# EAGLE design Qwiic_UV_Sensor_VEML6075 (EAGLE 9.1.0)
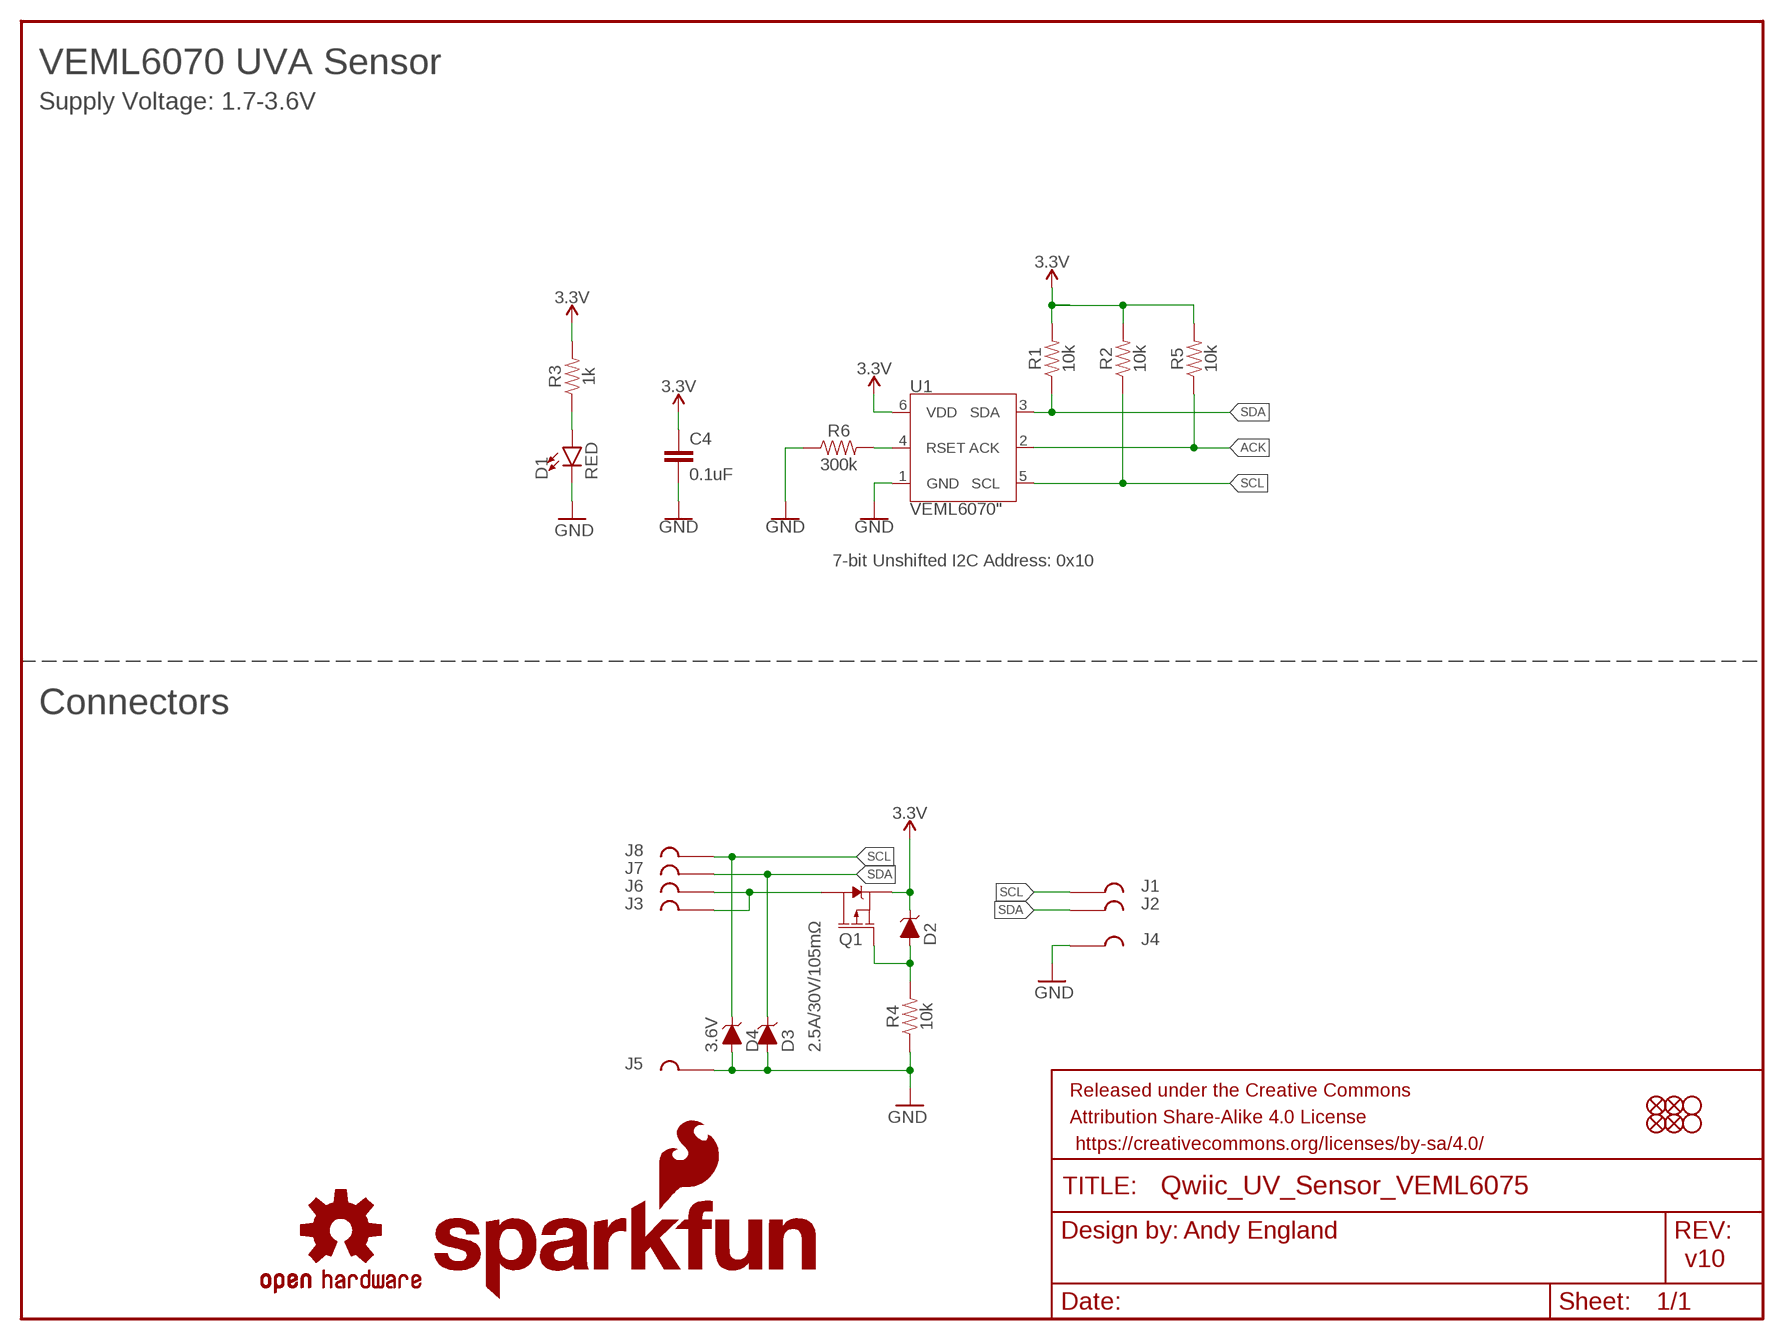
[diagram p0: schematic, sheet 1]

## Parts
C4  0.1uF  0.1UF-0603-25V-(+80/-20%)  [0603]
D1  RED  LED-RED0603  [LED-0603]
D2  3.6V  DIODE-ZENER-BZT52C3V6S  [SOD-323]
D3  3.6V  DIODE-ZENER-BZT52C3V6S  [SOD-323]
D4  3.6V  DIODE-ZENER-BZT52C3V6S  [SOD-323]
FRAME1  FRAME-LETTER  [CREATIVE_COMMONS]
J1  GATORGATOR_MINI  [GATOR_MINI]
J2  GATORGATOR_MINI  [GATOR_MINI]
J3  GATORGATOR_MINI  [GATOR_MINI]
J4  GATORGATOR_MINI  [GATOR_MINI]
J5  GATORGATOR_MINI  [GATOR_MINI]
J6  GATORGATOR_MINI  [GATOR_MINI]
J7  GATORGATOR_MINI  [GATOR_MINI]
J8  GATORGATOR_MINI  [GATOR_MINI]
JP2  FIDUCIALUFIDUCIAL  [MICRO-FIDUCIAL]
JP3  STAND-OFF  [STAND-OFF]
JP4  STAND-OFF  [STAND-OFF]
JP5  FIDUCIALUFIDUCIAL  [MICRO-FIDUCIAL]
JP6  FIDUCIALUFIDUCIAL  [MICRO-FIDUCIAL]
JP7  FIDUCIALUFIDUCIAL  [MICRO-FIDUCIAL]
LOGO1  OSHW-LOGOMINI  [OSHW-LOGO-MINI]
Q1  2.5A/30V/105mΩ  MOSFET_PCH-DMG2307L  [SOT23-3]
R1  10k  10KOHM-0603-1/10W-1%  [0603]
R2  10k  10KOHM-0603-1/10W-1%  [0603]
R3  1k  1KOHM-0603-1/10W-1%  [0603]
R4  10k  10KOHM-0603-1/10W-1%  [0603]
R5  10k  10KOHM-0603-1/10W-1%  [0603]
R6  300k  300KOHM-0603-1/10W-1%  [0603]
U1  VEML6070"  [VEML6070]
U$1  SFE_LOGO_NAME_FLAME.1_INCH  [SFE_LOGO_NAME_FLAME_.1]
U$2  SFE_LOGO_NAME_FLAME.1_INCH  [SFE_LOGO_NAME_FLAME_.1]

## Nets
3.3V: C4.1 D2.C Q1.2(S) R1.2 R2.2 R3.2 R5.2 U1.6(VDD)
ACK: R5.1 U1.2(ACK)
GND: C4.2 D1.C D3.A D4.A J4.P$2 J5.P$2 R4.1 R6.1 U1.1(GND)
N$1: J3.P$2 J6.P$2 Q1.3(D)
N$2: R6.2 U1.4(RSET)
N$3: D1.A R3.1
N$4: D2.A Q1.1(G) R4.2
SCL: D4.C J1.P$2 J8.P$2 R2.1 U1.5(SCL)
SDA: D3.C J2.P$2 J7.P$2 R1.1 U1.3(SDA)

## Notes on the sheet
- VEML6070 UVA Sensor
- Supply Voltage: 1.7-3.6V
- 7-bit Unshifted I2C Address: 0x10
- Connectors
- Andy England
- v10

## Library data of the parts
C4 = SparkFun-Capacitors:0.1UF: 0.1µF ceramic capacitors A capacitor is a passive two-terminal electrical component used to store electrical energy temporarily in an electric field.; PROD_ID: CAP-00810
D1 = SparkFun-LED:LED-RED: Red SMD LED Used in manufacturing of most products at SparkFun Packages: 0603 - SMD 0603 package [Product Link] <http://docs.avagotech.com/docs/AV02-0551EN> 0603 SMART - SMD 0603 SMART package ( more efficient and expensive)[Product Link] <http://www.osram-os.com/Graphics/XPic2/00077099_0.pdf> 1206 - SMD1206 package [Product Link] <https://www.sparkfun.com/datasheets/DevTools/LilyPad/Q150OVS4.pdff> SparkFun Products: Pro Mini 328 -5V <https://www.sparkfun.com/products/821> RedBoard <https://www.sparkfun.com/products/12757> IOIO-OTG <https://www.sparkfun.com/products/13613>; PROD_ID: DIO-00819
D2-D4 = SparkFun-DiscreteSemi:DIODE-ZENER: Zener Diode A Zener diode allows current to flow from its anode to its cathode like a normal semiconductor diode, but it also permits current to flow in the reverse direction when its "Zener voltage" is reached. - WIkipedia; PROD_ID: DIO-08199
FRAME1 = SparkFun-Aesthetics:FRAME-LETTER: Schematic Frame - Letter Standard 8.5x11 US Letter frame
J1-J8 = SparkFun-Connectors:GATOR
JP2 JP5-JP7 = SparkFun:FIDUCIAL: Fiducial Alignment Points Various fiducial points for machine vision alignment.
JP3 JP4 = SparkFun:STAND-OFF: Stand Off This is the mechanical footprint for a #4 phillips button head screw. Use the keepout ring to avoid running the screw head into surrounding components. SKU : PRT-00447
LOGO1 = SparkFun-Aesthetics:OSHW-LOGO: Open-Source Hardware (OSHW) Logo This logo indicates the piece of hardware it is found on incorporates a OSHW license and/or adheres to the definition of open source hardware found here: http://freedomdefined.org/OSHW
Q1 = SparkFun-DiscreteSemi:MOSFET_PCH: P-channel MOSFETs Voltage controlled devices that allow control of high current outputs. SparkFun Products: SparkFun ESP32 Thing <https://www.sparkfun.com/products/13907> SparkFun ESP8266 Thing <https://www.sparkfun.com/products/13231>; PROD_ID: TRANS-11308
R1 R2 R4 R5 = SparkFun-Resistors:10KOHM: 10kΩ resistor A resistor is a passive two-terminal electrical component that implements electrical resistance as a circuit element. Resistors act to reduce current flow, and, at the same time, act to lower voltage levels within circuits. - Wikipedia; PROD_ID: RES-00824
R3 = SparkFun-Resistors:1KOHM: 1kΩ resistor A resistor is a passive two-terminal electrical component that implements electrical resistance as a circuit element. Resistors act to reduce current flow, and, at the same time, act to lower voltage levels within circuits. - Wikipedia; PROD_ID: RES-07856
R6 = SparkFun-Resistors:300KOHM: 300kΩ resistor A resistor is a passive two-terminal electrical component that implements electrical resistance as a circuit element. Resistors act to reduce current flow, and, at the same time, act to lower voltage levels within circuits. - Wikipedia; PROD_ID: RES-10809
U1 = SparkFun-Sensors:VEML6070
U$1 U$2 = SparkFun-Aesthetics:SFE_LOGO_NAME_FLAME: SparkFun Font Logo w/ Flame This is the SparkFun full logo. The logo on the schematic will always be the same size; the package variant is the height of the flame part of the logo. Default layer for the logo on the board is tSilk.

## Board
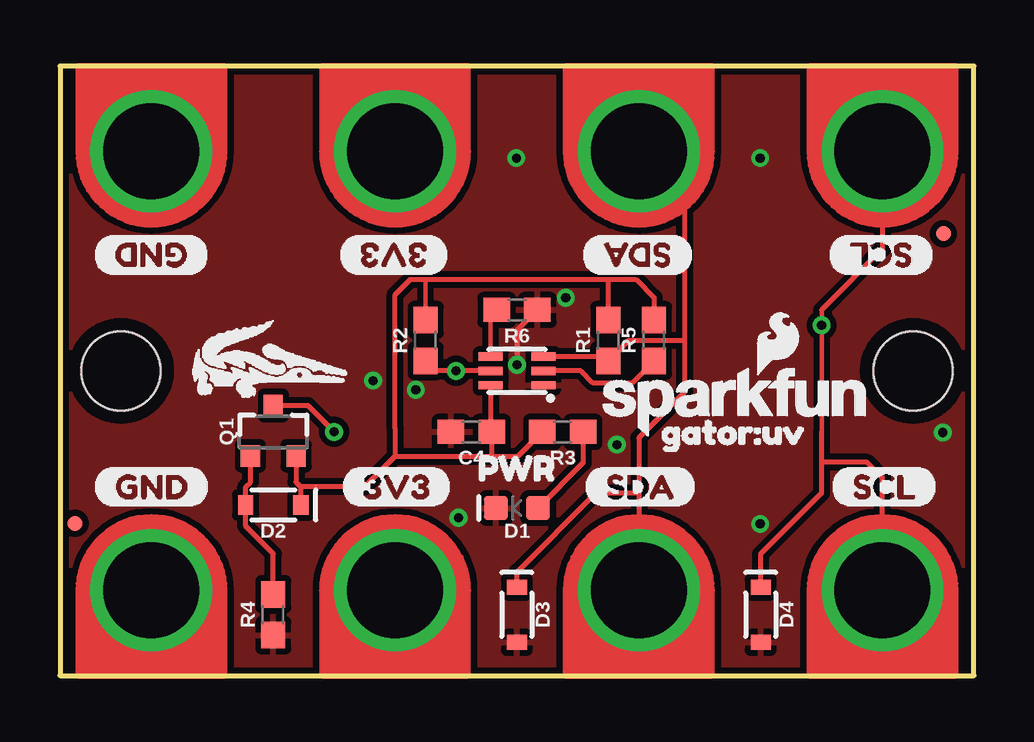
[diagram p1: board, top side]
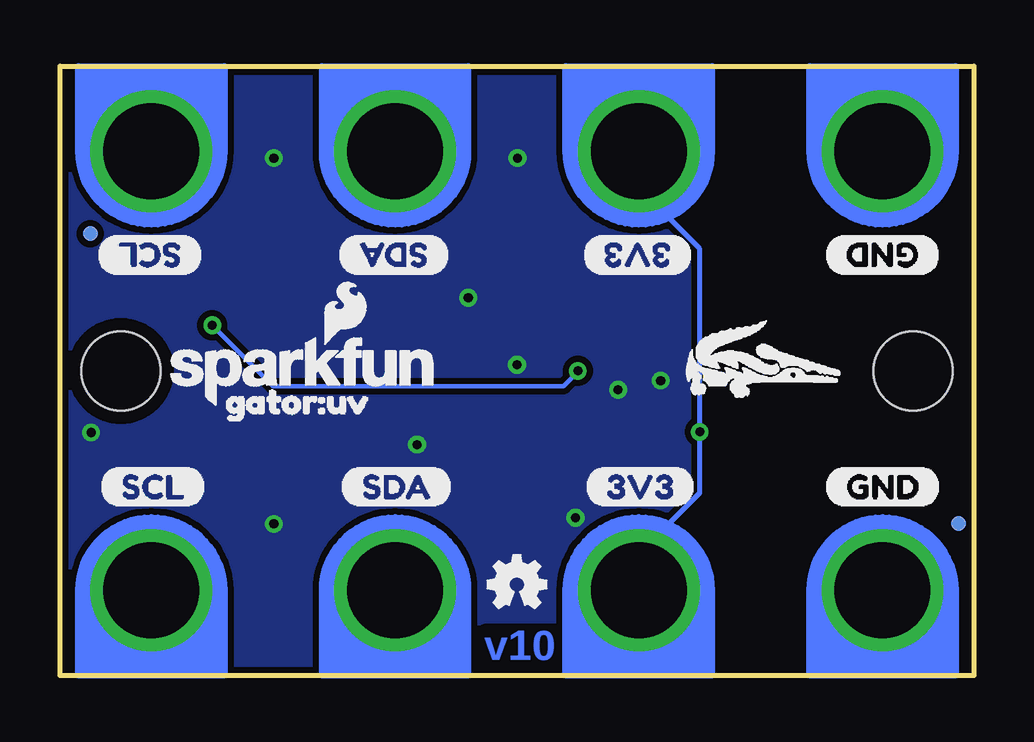
[diagram p2: board, bottom side, seen from below]

Size 38.1 x 25.4 mm. Coordinates in mm from the lower left corner, seen from the top.
Outline: 0,0 38.1,0 38.1,25.4 0,25.4 0,0
Copper layers (1*16): Top 0.035mm / dielectric 1.5mm / Bottom 0.035mm
Design rules "SparkFun-2-layer-TIGHT": minimum track width 7mil, minimum drill 15mil, track to track 7mil, track to pad 7mil, pad to pad 7mil, via to via 7mil, smd to smd 7mil, copper to edge 7mil, drill to drill 7mil, minimum pad ring 7mil, minimum via ring 7mil, stop-mask expansion 4mil, vias tented up to drill 25mil, thermal gap 10mil

### Footprints (pad centres in the part's own frame; a part is rotated, then mirrored left to right if it is on the bottom)
0603 = smd 1.1 x 1: 1 -0.85,0; 2 0.85,0
LED-0603 = smd 1 x 1: A -0.877,0; C 0.877,0
SOD-323 = smd 0.63 x 0.83: A 1.15,0; C -1.15,0
GATOR_MINI = drill 4 pad 5.08: P$2 0,-0.254
MICRO-FIDUCIAL = smd 0.635 x 0.635: 1 0,0
STAND-OFF = hole 3.302: 0,0
SOT23-3 = smd 0.8 x 0.9: 1 -0.95,-1; 2 0.95,-1; 3 0,1.1
VEML6070 = smd 1 x 0.35: 1 -1.1,0.6; 2 -1.1,0; 3 -1.1,-0.6; 4 1.1,-0.6; 5 1.1,0; 6 1.1,0.6

### Placement (x,y rotation side)
C4  17.14,10.16 180 top
D1  19.05,6.99 180 top
D2  8.89,7.11 180 top
D3  19.05,2.54 270 top
D4  29.21,2.54 270 top
FRAME1  -11.43,-7.62 0 top  (outside the outline)
J1  34.29,3.81 0 top
J2  24.13,3.81 0 top
J3  13.97,3.81 0 top
J4  3.81,3.81 0 top
J5  3.81,21.59 180 top
J6  13.97,21.59 180 top
J7  24.13,21.59 180 top
J8  34.29,21.59 180 top
JP2  0.64,6.35 0 bottom
JP3  2.54,12.7 0 top
JP4  35.56,12.7 90 top
JP5  0.64,6.35 0 top
JP6  36.83,18.41 0 top
JP7  36.83,18.41 0 bottom
LOGO1  19.05,3.81 0 bottom
Q1  8.89,10.16 0 top
R1  22.86,13.97 90 top
R2  15.24,13.97 90 top
R3  20.95,10.16 180 top
R4  8.89,2.54 90 top
R5  24.77,13.97 90 top
R6  19.05,15.24 180 top
U1  19.05,12.7 180 top
U$1  28.19,11.43 0 top
U$2  27.94,12.7 0 bottom
U$3  [3V33]  11.68,7.87 0 top
U$4  [GND0]  1.4,7.87 0 top
U$5  [SCL2]  32.13,7.87 0 top
U$6  [GATOR#UV5]  24.13,10.16 0 top
U$7  [SDA1]  21.84,7.87 0 top
U$8  [3V33]  11.68,17.53 180 bottom
U$9  [GND0]  1.4,17.53 180 bottom
U$10  [ORDERING_INSTRUCTIONS]  1.27,-10.16 0 top  (outside the outline)
U$11  [SCL2]  32.13,17.53 180 bottom
U$12  [SDA1]  21.84,17.53 180 bottom
U$13  [GND0]  6.22,17.53 180 top
U$14  [3V33]  16.26,17.53 180 top
U$15  [SDA1]  26.42,17.53 180 top
U$17  [SCL2]  36.45,17.53 180 top
U$18  [GND0]  6.22,7.87 0 bottom
U$19  [3V33]  16.26,7.87 0 bottom
U$20  [SDA1]  26.42,7.87 0 bottom
U$21  [SCL2]  36.45,7.87 0 bottom
U$22  [GATORBIT_FINAL_FOR_SILK#01#PNG]  8.76,13.21 0 top
U$23  [GATORBIT_FINAL_FOR_SILK#01#PNG]  8.76,13.21 0 bottom
U$24  [GATOR#UV5]  32.13,11.43 0 bottom
U$25  [PWR0]  16.51,8.64 0 top

### Tracks (layer width: path | path; a pad name or v marks a point on that pad's centre or on a via)
3.3V
  Top 0.178: R2.2 15.24,16.51
  Top 0.203: 10.04,7.87 D2.C | Q1.2 9.84,8.07 10.04,7.87 | 10.04,7.87 12.69,7.87 13.97,9.14 | R5.2 24.77,15.75 24,16.51 22.86,16.51 | 22.86,16.51 16.51,16.51 15.24,16.51 14.61,16.51 13.97,15.88 13.97,10.29 13.97,10.16 | R1.2 22.86,16.51 | 13.97,10.16 | 13.97,10.16 13.97,9.14 | 13.97,9.14 17.4,9.14 18,9.14 | 18,9.14 19.09,9.14 R3.2 | U1.6 17.95,10.21 C4.1 18,9.14
ACK
  Top 0.203: R5.1 23.84,12.19 22.23,12.19 21.72,12.7 U1.2
GND  (via drill 0.38)
  Top 0.203: R6.1 19.05,14.39 v19.05,12.95
  other vias: 16.61,6.58 13.06,12.29 23.22,9.63 14.83,11.91 19.02,21.56 29.18,21.56 29.18,6.32 36.8,10.13 21.08,15.75
  pour Top (isolate 0.254): 0,25.4 0,0 38.1,0 38.1,25.4
  pour Bottom (isolate 0.254): 38.1,25.4 38.1,0 0,0 0,25.4
N$1  (via drill 0.38)
  Top 0.203: Q1.3 10.33,11.26 v11.43,10.16
  Bottom 0.203: J3.P$2 13.97,5.08 11.43,7.62 v11.43,10.16 11.43,17.78 13.97,20.32 J6.P$2
N$2
  Top 0.178: U1.4 17.95,14.99 R6.2
N$3
  Top 0.203: R3.1 21.8,8.86 D1.A
N$4
  Top 0.203: R4.2 8.89,5.08 7.74,6.23 D2.A 7.74,7.87 7.94,8.07 Q1.1
SCL  (via drill 0.38)
  Top 0.178: 31.75,15.24 v31.75,14.61 31.75,10.16
  Top 0.203: J8.P$2 34.29,17.78 31.75,15.24 | J1.P$2 34.29,7.62 34.29,8.26 33.66,8.89 31.75,8.89 | D4.C 29.21,5.08 31.75,7.62 31.75,8.89 | 31.75,8.89 31.75,10.16 | U1.5 v16.51,12.7 15.66,12.7 R2.1
  Bottom 0.178: v31.75,14.61 29.21,12.06 17.12,12.06 16.51,12.67 v16.51,12.7
SDA
  Top 0.203: 26.04,13.97 26.04,19.94 J7.P$2 | 26.04,13.97 26.04,11.81 24.13,9.91 24.13,7.62 | 24.13,7.62 J2.P$2 | D3.C 19.05,4.32 22.35,7.62 24.13,7.62 | U1.3 22.68,13.3 R1.1 23.71,13.97 26.04,13.97

### Text on the board
Bottom: v10
Measures: Units in Inches
tDocu: Andy England | Black Gloss Soldermask